# EasyEDA schematic ESP32 RC522 ACS712 NUTNHAN RELAY.json
TITLE: Sheet_1; REV: 1.0; Date: 2022-01-17; Sheet: 1/1; Company: Your Company
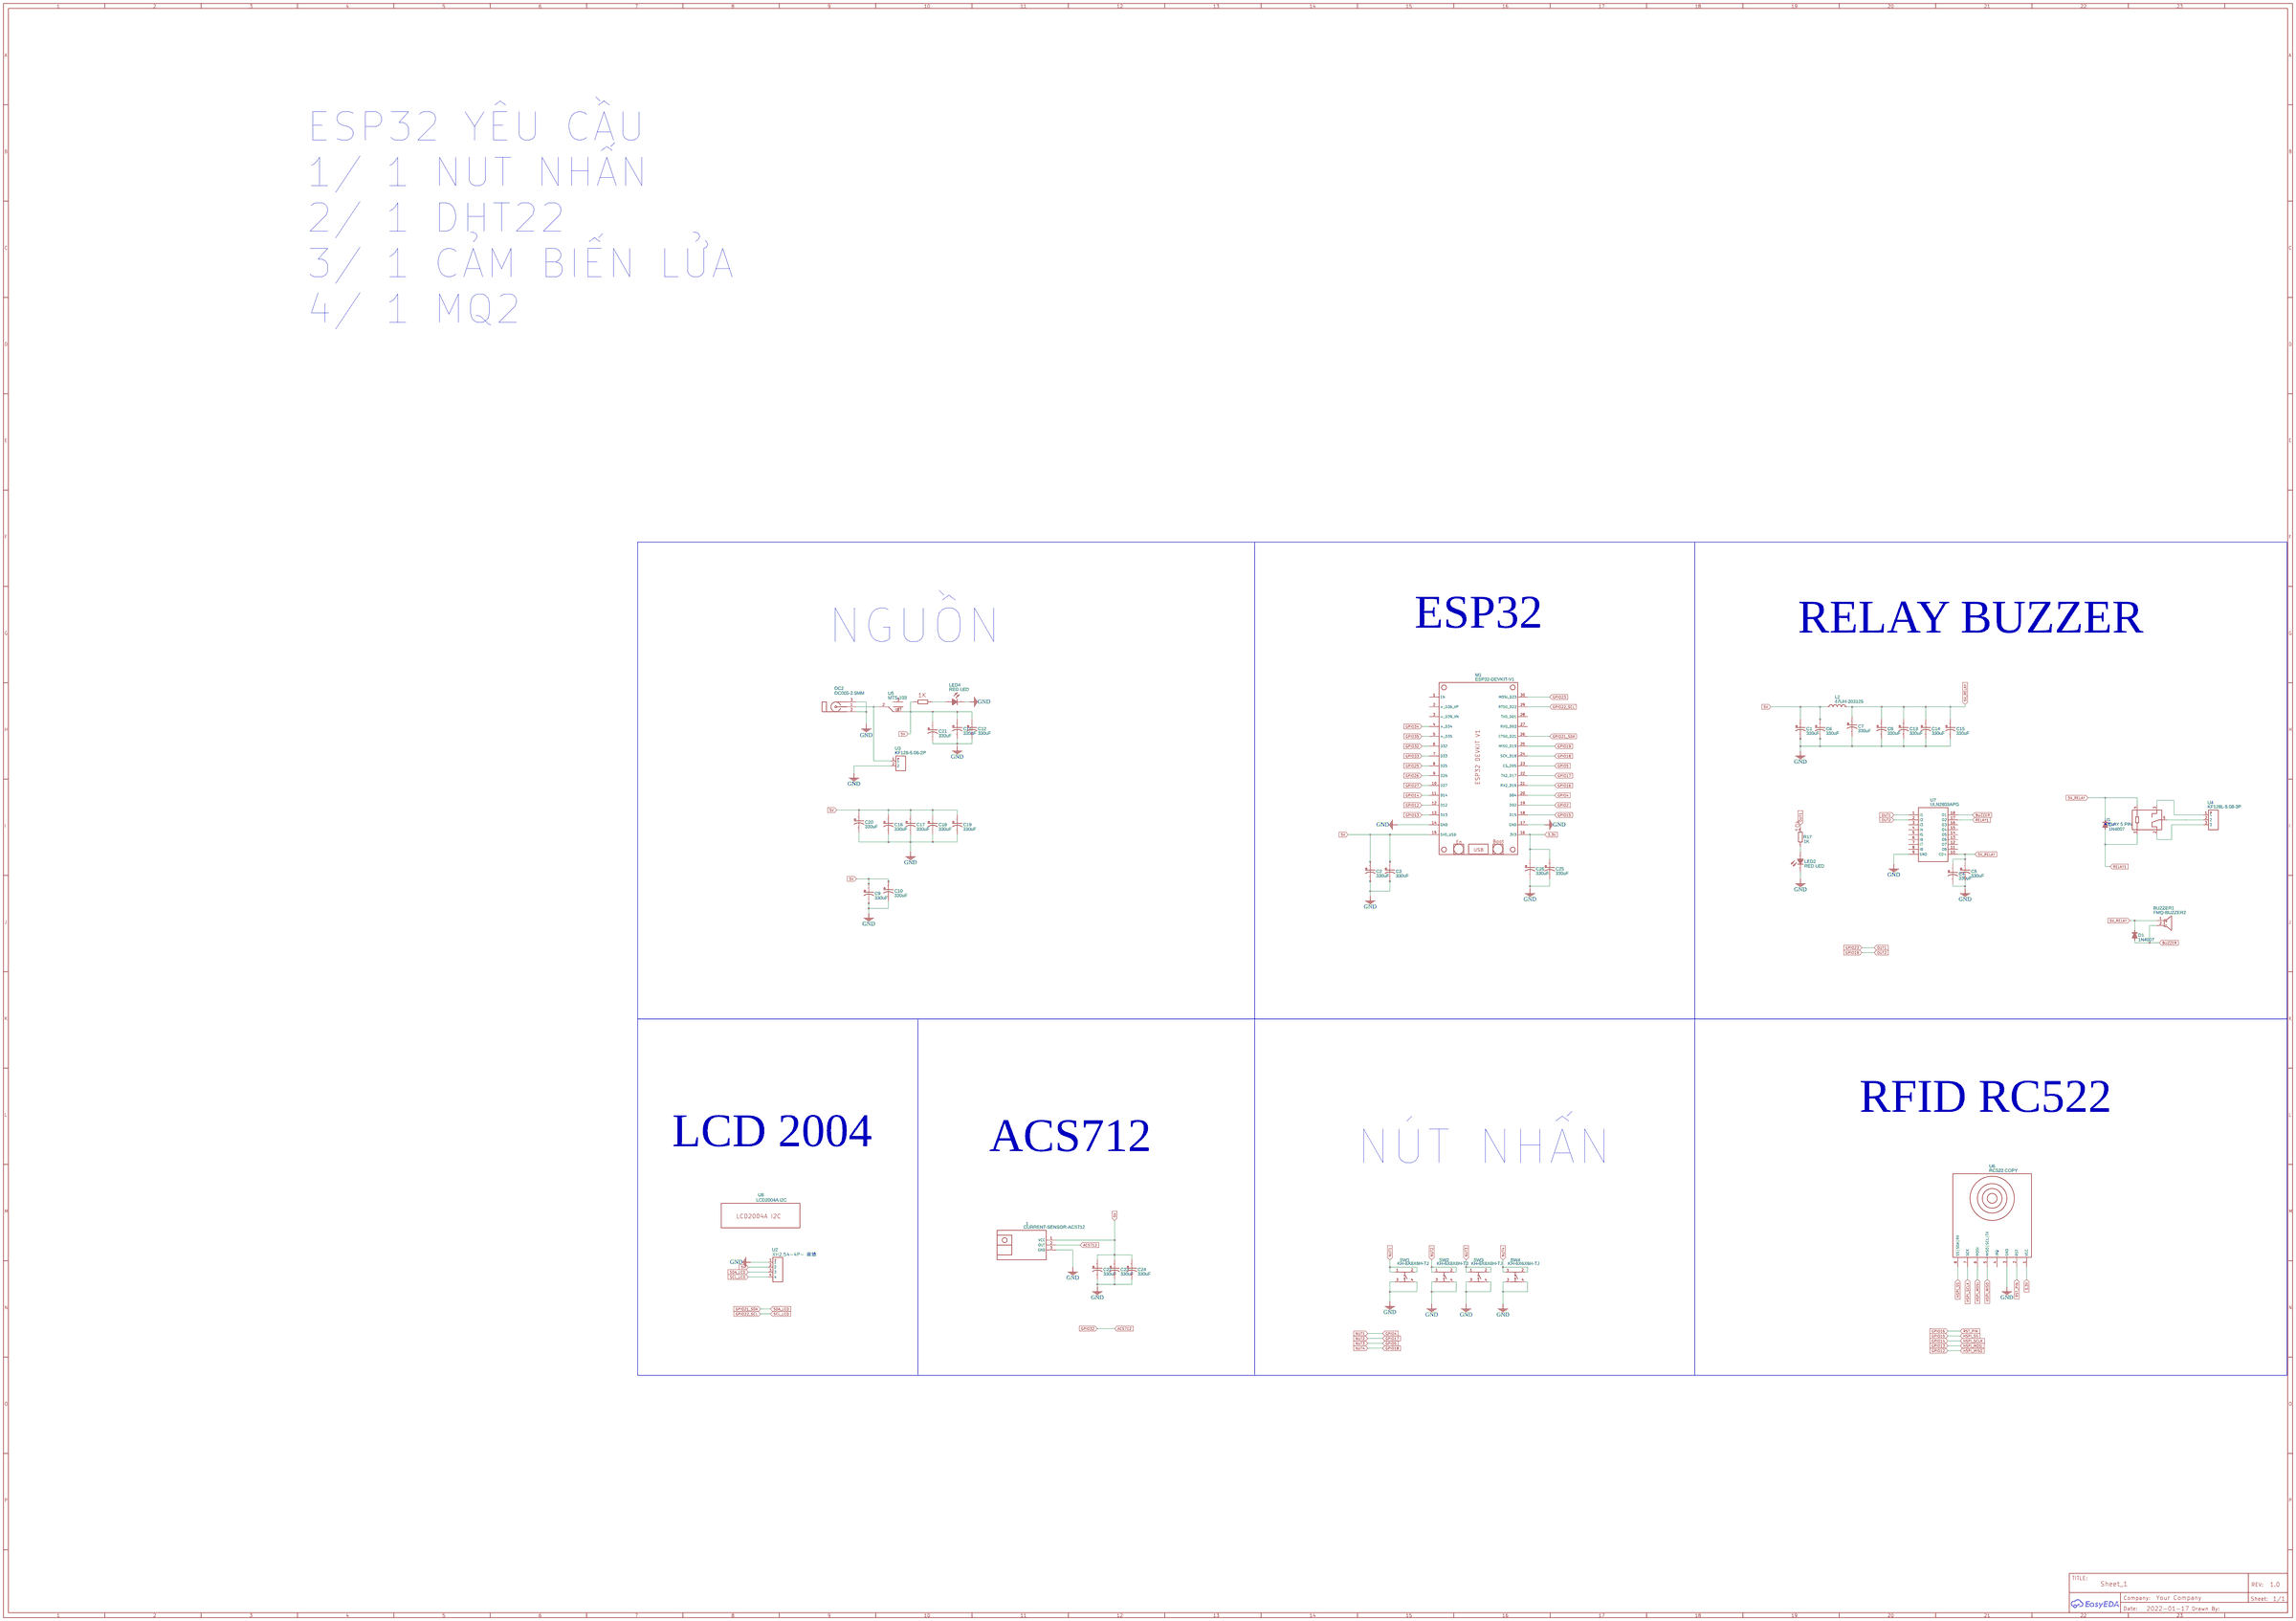
[diagram p0: schematic sheet]

## Parts
1  CURRENT-SENSOR-ACS712  [CURRENT-SENSOR-ACS712]
BUZZER1  FMQ-BUZZER2  [BUZ-TH_BD12.0-P7.60-D0.6-FD]
C1  330uF  [CAP-TH_BD8.0-P3.50-D0.6-FD]
C2  330uF  [CAP-TH_BD8.0-P3.50-D0.6-FD]
C3  330uF  [CAP-TH_BD8.0-P3.50-D0.6-FD]
C4  330uF  [CAP-TH_BD8.0-P3.50-D0.6-FD]
C5  330uF  [CAP-TH_BD8.0-P3.50-D0.6-FD]
C6  330uF  [CAP-TH_BD8.0-P3.50-D0.6-FD]
C7  330uF  [CAP-TH_BD8.0-P3.50-D0.6-FD]
C8  330uF  [CAP-TH_BD8.0-P3.50-D0.6-FD]
C9  330uF  [CAP-TH_BD8.0-P3.50-D0.6-FD]
C10  330uF  [CAP-TH_BD8.0-P3.50-D0.6-FD]
C11  330uF  [CAP-TH_BD8.0-P3.50-D0.6-FD]
C12  330uF  [CAP-TH_BD8.0-P3.50-D0.6-FD]
C13  330uF  [CAP-TH_BD8.0-P3.50-D0.6-FD]
C14  330uF  [CAP-TH_BD8.0-P3.50-D0.6-FD]
C15  330uF  [CAP-TH_BD8.0-P3.50-D0.6-FD]
C16  330uF  [CAP-TH_BD8.0-P3.50-D0.6-FD]
C17  330uF  [CAP-TH_BD8.0-P3.50-D0.6-FD]
C18  330uF  [CAP-TH_BD8.0-P3.50-D0.6-FD]
C19  330uF  [CAP-TH_BD8.0-P3.50-D0.6-FD]
C20  330uF  [CAP-TH_BD8.0-P3.50-D0.6-FD]
C21  330uF  [CAP-TH_BD8.0-P3.50-D0.6-FD]
C22  330uF  [CAP-TH_BD8.0-P3.50-D0.6-FD]
C23  330uF  [CAP-TH_BD8.0-P3.50-D0.6-FD]
C24  330uF  [CAP-TH_BD8.0-P3.50-D0.6-FD]
C25  330uF  [CAP-TH_BD8.0-P3.50-D0.6-FD]
C26  330uF  [CAP-TH_BD8.0-P3.50-D0.6-FD]
D1  1N4007  [1N4007]
D4  1N4007  [1N4007]
DC2  DC005-2.5MM  [DC-IN-TH_DC-005-20A]
L2  47UH-203125  [IND-TH_L24.6-W10.0-P8.85-D1.3]
LED2  RED LED  [LED-5MM-2.54MM]
LED4  RED LED  [LED-5MM-2.54MM]
M1  ESP32-DEVKIT-V1  [ESP32-DEVKIT-V1-MODULE]
R2  1K  [RESISTOR 1K OHM]
R17  1K  [RESISTOR 1K OHM]
SW1  KH-6X6X6H-TJ  [SW-TH_4P-L6.0-W6.0-P4.50-LS6.5]
SW2  KH-6X6X6H-TJ  [SW-TH_4P-L6.0-W6.0-P4.50-LS6.5]
SW3  KH-6X6X6H-TJ  [SW-TH_4P-L6.0-W6.0-P4.50-LS6.5]
SW4  KH-6X6X6H-TJ  [SW-TH_4P-L6.0-W6.0-P4.50-LS6.5]
U1  RELAY 5 PIN  [RELAY 5 PIN]
U2  XH2.54-4P- 直插  [CONN-TH_4P-P2.50-XH2.54-4P]
U3  KF128-5.08-2P  [CONN-TH_P5.08_KF128-5.08-2P]
U4  KF128L-5.08-3P  [CONN-TH_3P-P5.08_KF128L-5.08-3P]
U5  MTS-103  [MTS-103]
U6  RC522 COPY  [RFID-RC522]
U7  ULN2803APG  [DIP-18_L23.0-W6.5-P2.54-LS7.6-BL]
U8  LCD2004A I2C  [LCD2004A]

## Library data of the parts
1 = CURRENT-SENSOR-ACS712: Contributor: mariusz.kacprzak
BUZZER1 = FMQ-BUZZER2: Supplier: LCSC; Supplier Part: C9900006103; JLCPCB Part Class: Extended Part; Contributor: LCSC
C1-C26 = NXA 16V330 8*11.5: Supplier: LCSC; Supplier Part: C165541; Manufacturer: SamYoung Electronics; Contributor: LCSC; JLCPCB Part Class: Extended Part
D1 D4 = 1N4007: Contributor: Srinivasan
DC2 = DC005-2.5MM: Supplier: LCSC; Manufacturer: SOFNG; Supplier Part: C111573
L2 = 47UH-203125: Supplier: LCSC; Supplier Part: C9900004701; Manufacturer Part: 47uH-203125; JLCPCB Part Class: Extended Part; Contributor: LCSC
LED2 LED4 = RED LED: Supplier: LCSC; Manufacturer: EVERLIGHT; Manufacturer Part: 333-2SURD/S530-A3; Supplier Part: C87271
M1 = ESP32-DEVKIT-V1: Manufacturer Part: ESP32 Module - Doit.am; Contributor: Mike Matheson
R2 R17 = resistor 10k ohm: Supplier Part: C348856; Manufacturer: ResistorToday; Manufacturer Part: EWWR0003J1K00T9; Contributor: Rio Anderson; JLCPCB Part Class: Extended Part
SW1-SW4 = KH-6X6X6H-TJ: Supplier: LCSC; Supplier Part: C2837516; Manufacturer: kinghelm(金航标); Contributor: LCSC; JLCPCB Part Class: Extended Part
U1 = RELAY 5 PIN: Contributor: projakjo
U2 = XH2.54-4P- 直插: Supplier: LCSC; Supplier Part: C9900000103; Manufacturer: null; JLCPCB Part Class: Extended Part; Contributor: LCSC
U3 = KF128-5.08-2P: Supplier: LCSC; Supplier Part: C474952; Manufacturer: Cixi Kefa Elec; Contributor: LCSC; JLCPCB Part Class: Extended Part
U4 = KF128L-5.08-3P: Supplier: LCSC; Supplier Part: C474941; Manufacturer: Cixi Kefa Elec; Contributor: LCSC; JLCPCB Part Class: Extended Part
U5 = MTS-103: link: https://www.taydaelectronics.com/mini-toggle-switch-spdt-on-off-on-mts-103-c1.html; Contributor: Tong He (ht93)
U6 = RC522 COPY: Contributor: edgdsj
U7 = ULN2803APG: Supplier: LCSC; Manufacturer: TOSHIBA; Supplier Part: C5252
U8 = LCD2004A I2C: Contributor: AndreyN71

## Nets
3.3V: C25.1 C26.1 M1.16(3V3) U6.1(VCC)
5V: 1.1(VCC) C1.1 C2.1 C3.1 C6.1 C9.1 C10.1 C11.1 C12.1 C16.1 C17.1 C18.1 C19.1 C20.1 C21.1 C22.1 C23.1 C24.1 L2.1 M1.15(5V0 USB) R2.1 U2.2 U5.1
5V_RELAY: BUZZER1.1 C4.1 C5.1 C7.1 C8.1 C13.1 C14.1 C15.1 D1.K D4.K L2.2 U1.4 U7.10(CD+)
GND: 1.3(GND) C1.2 C2.2 C3.2 C4.2 C5.2 C6.2 C7.2 C8.2 C9.2 C10.2 C11.2 C12.2 C13.2 C14.2 C15.2 C16.2 C17.2 C18.2 C19.2 C20.2 C21.2 C22.2 C23.2 C24.2 C25.2 C26.2 DC2.2 DC2.3 LED2.2(C) LED4.2(C) M1.14(GND) M1.17(GND) SW1.3 SW1.4 SW2.3 SW2.4 SW3.3 SW3.4 SW4.3 SW4.4 U2.1 U3.2 U6.3(GND) U7.9(GND)
ACS712: 1.2(OUT) M1.6(D32)
BUZZER: BUZZER1.2 D1.A U7.18(O1)
GPIO2: M1.19(D02)
GPIO4: M1.20(D04) SW1.1 SW1.2
GPIO5: M1.23(CS D05) SW3.1 SW3.2
GPIO12: M1.12(D12) U6.5(MISO|SCL|TX)
GPIO13: M1.13(D13) U6.6(MOSI)
GPIO14: M1.11(D14) U6.7(SCK)
GPIO15: M1.18(D15) U6.8(SS|SDA|RX)
GPIO16: M1.21(RX2 D16) U6.2(RST)
GPIO17: M1.22(TX2 D17) SW2.1 SW2.2
GPIO18: M1.24(SCK D18) SW4.1 SW4.2
GPIO19: M1.25(MISO D19) U7.2(I2)
GPIO21_SDA: M1.26(CTS0 D21) U2.3
GPIO22_SCL: M1.29(RTS0 D22) U2.4
GPIO23: M1.30(MOSI D23) R17.1 U7.1(I1)
GPIO25: M1.8(D25)
GPIO26: M1.9(D26)
GPIO27: M1.10(D27)
GPIO33: M1.7(D33)
GPIO34: M1.4(> D34)
GPIO35: M1.5(> D35)
RELAY1: D4.A U1.1 U7.17(O2)
Net-(DC2-1): DC2.1(VCC) U3.1 U5.2
Net-(LED2-1): LED2.1(A) R17.2
Net-(LED4-1): LED4.1(A) R2.2
Net-(U1-2): U1.2 U4.3
Net-(U1-3): U1.3 U4.1
Net-(U1-5): U1.5 U4.2

Not connected (* = marked no-connect by the designer): M1 1(EN) 2(> D36 VP) 3(> D39 VN) 27(RX0 D03) 28(TX0 D01); U5 3; U6 4(IRQ); U7 3(I3) 4(I4) 5(I5) 6(I6) 7(I7) 8(I8) 11(O8) 12(O7) 13(O6) 14(O5) 15(O4) 16(O3)

## Notes on the sheet
- ESP32 YÊU CẦU
  1/ 1 NUT NHẤN
  2/ 1 DHT22
  3/ 1 CẢM BIẾN LỬA
  4/ 1 MQ2
- ESP32
- NGUỒN
- RELAY BUZZER
- RFID RC522
- LCD 2004
- ACS712
- NÚT NHẤN
